# EAGLE design MARINEFORD (EAGLE 9.0.0)
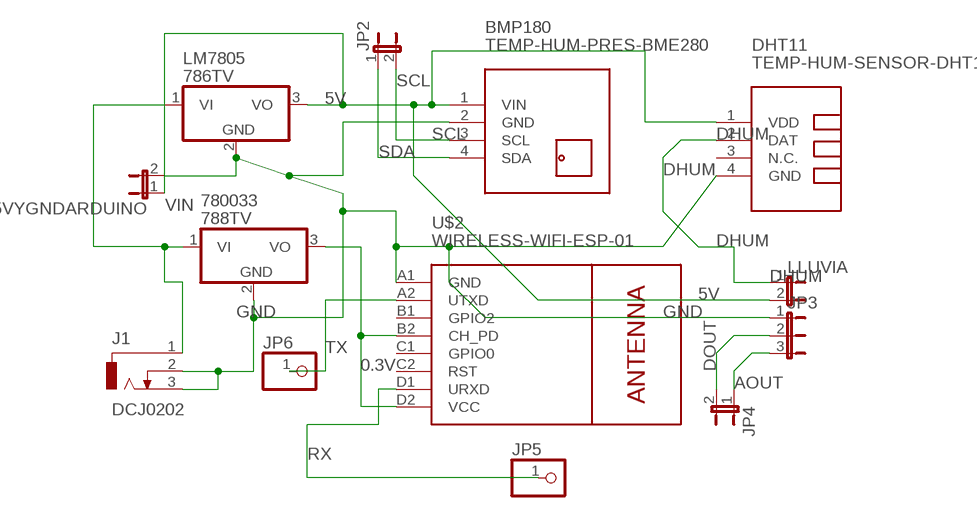
[diagram p0: schematic, sheet 1]

## Parts
5VYGNDARDUINO  JP1E  [JP1]
780033  788TV  [TO220V]
BMP180  TEMP-HUM-PRES-BME280  [TEMP-HUM-PRES-BME280]
DHT11  TEMP-HUM-SENSOR-DHT11  [TEMP-HUM-SENSOR-DHT11]
J1  DCJ0202  [DCJ0202]
JP2  JP1E  [JP1]
JP3  JP2E  [JP2]
JP4  JP1E  [JP1]
JP5  PINHD-1X1  [1X01]
JP6  PINHD-1X1  [1X01]
LLUVIA  JP1E  [JP1]
LM7805  786TV  [TO220V]
U$2  WIRELESS-WIFI-ESP-01  [WIRELESS-WIFI-ESP-01]

## Nets
0.3V: 780033.3(VO) U$2.B2(CH_PD) U$2.D2(VCC)
5V: 5VYGNDARDUINO.1 BMP180.1(VIN) DHT11.1(VDD) LLUVIA.2 LM7805.3(VO)
AOUT: JP3.3 JP4.1
DHUM: DHT11.2(DAT) LLUVIA.1
DOUT: JP3.2 JP4.2
GND: 5VYGNDARDUINO.2 780033.2(GND) BMP180.2(GND) DHT11.4(GND) J1.2 J1.3 JP3.1 LM7805.2(GND) U$2.A1(GND)
RX: JP5.1 U$2.D1(URXD)
SCL: BMP180.3(SCL) JP2.2
SDA: BMP180.4(SDA) JP2.1
TX: JP6.1 U$2.A2(UTXD)
VIN: 780033.1(VI) J1.1 LM7805.1(VI)
Unconnected: DHT11.3(N.C.) U$2.B1(GPIO2) U$2.C1(GPIO0) U$2.C2(RST)

## Library data of the parts
5VYGNDARDUINO JP2 JP4 LLUVIA = jumper:JP1E: JUMPER
780033 LM7805 = linear:78*: Positive VOLTAGE REGULATOR Source: http://cache.national.com/ds/LM/LM78L05.pdf http://www.fairchildsemi.com/ds/LM/LM7805.pdf
BMP180 = BME280:TEMP-HUM-PRES-BME280: Digital Humidity-Temperature-Pressure Sensor based on BME280 device More information about BME280 device is available here: https://www.bosch-sensortec.com/bst/products/all_products/bme280 Click here to find device on ebay.com <http://www.ebay.com/sch/bme280+breakout>
DHT11 = dht11:TEMP-HUM-SENSOR-DHT11: DHT11 - digital humidity & temperature sensor DHT11 datasheet available here: https://akizukidenshi.com/download/ds/aosong/DHT11.pdf Click here to find device on ebay.com <http://www.ebay.com/sch/dht11+digital+sensor>
J1 = con-jack:DCJ0202: DC POWER JACK Source: DCJ0202.pdf; OC_FARNELL: unknown; OC_NEWARK: unknown
JP3 = jumper:JP2E: JUMPER
JP5 JP6 = adafruit:PINHD-1X1: Pin header 1x1 for 0.1" spacing With round pins
U$2 = dht11:WIRELESS-WIFI-ESP-01: Wireless Wi-Fi ESP-01 Module based on ESP8266 chip Click here to find device on ebay.com <http://www.ebay.com/sch/esp8266+esp+01+transceiver>

## Board
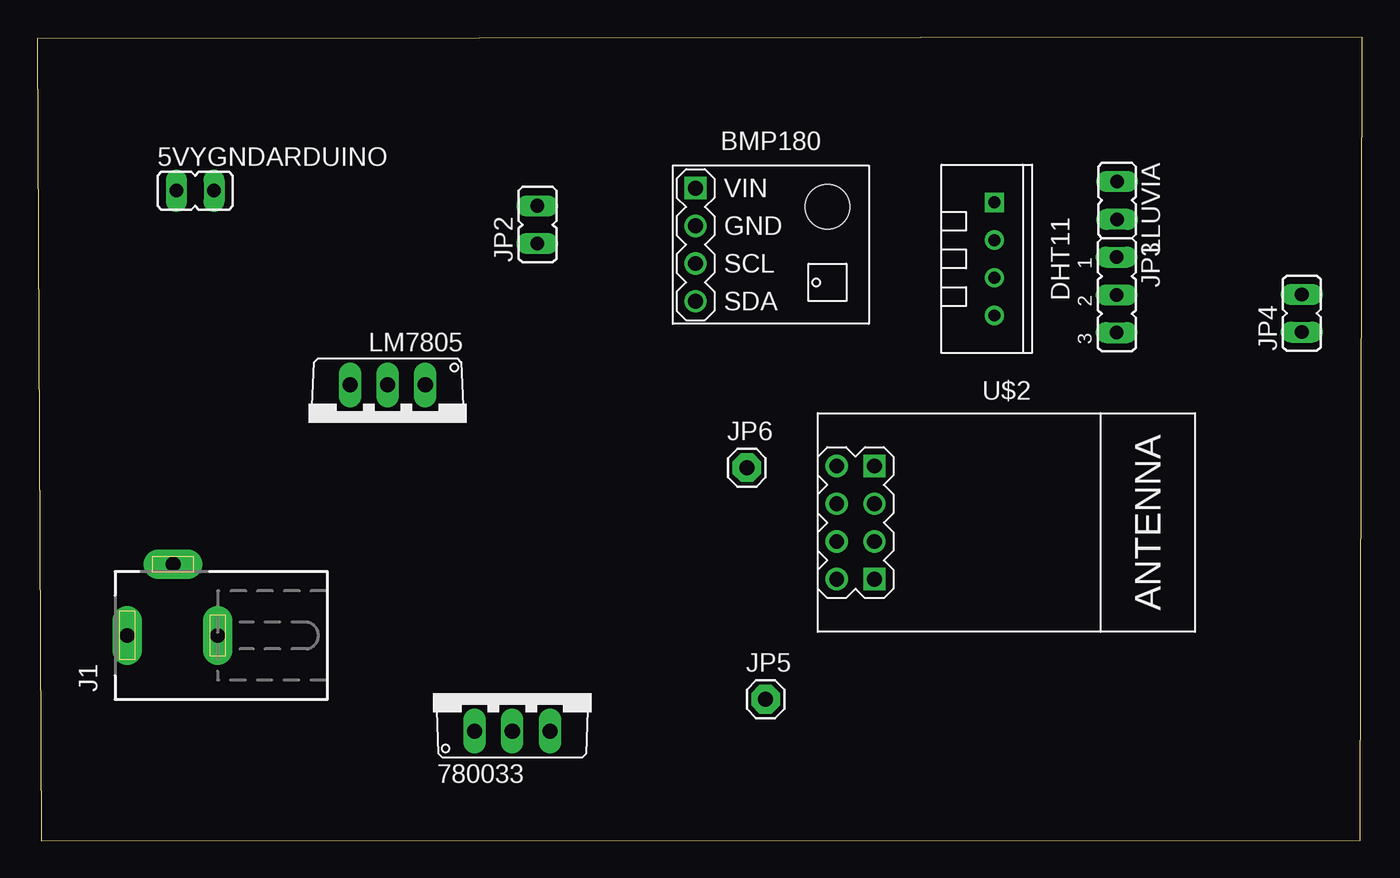
[diagram p1: board, top side]
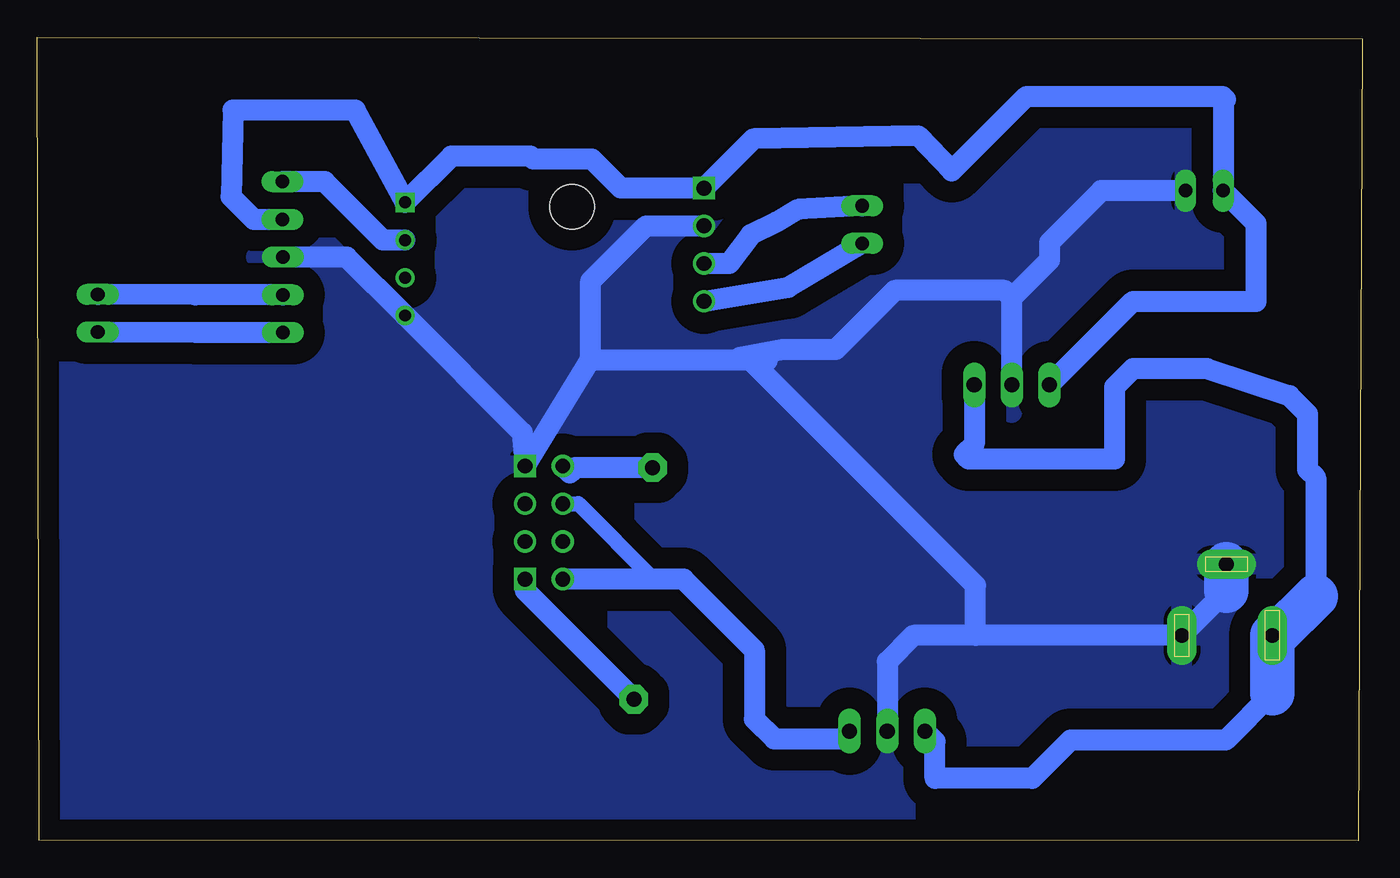
[diagram p2: board, bottom side, seen from below]

Size 89.3 x 54.13 mm. Coordinates in mm from the lower left corner, seen from the top.
Outline: 0.3,0 89.14,0.04 89.3,54.13 0,54.01 0.3,0
Copper layers (1*16): Top 0.035mm / dielectric 1.5mm / Bottom 0.035mm
Design rules "default *": minimum track width 6mil, minimum drill 0.35mm, track to track 15mil, track to pad 15mil, pad to pad 6mil, via to via 6mil, smd to smd 6mil, copper to edge 40mil, drill to drill 6mil, minimum pad ring 10mil, minimum via ring 8mil, stop-mask expansion 4mil, vias tented up to drill 0mil, thermal gap 10mil

### Footprints (pad centres in the part's own frame; a part is rotated, then mirrored left to right if it is on the bottom)
JP1 = drill 0.914 long: 1 0,-1.27; 2 0,1.27
TO220V = drill 1.016 long: 1 -2.54,-2.54; 2 0,-2.54; 3 2.54,-2.54
TEMP-HUM-PRES-BME280 = drill 1 square: 1 -5.08,3.81 | drill 1: 2 -5.08,1.27; 3 -5.08,-1.27; 4 -5.08,-3.81 | hole 3: 3.81,2.54
TEMP-HUM-SENSOR-DHT11 = drill 0.8 square: 1 -3.81,0 | drill 0.8: 2 -1.27,0; 3 1.27,0; 4 3.81,0
DCJ0202 = drill 1 pad 2 long: 1 0,3.1; 2 4.8,0; 3 0,-3
JP2 = drill 0.914 long: 1 -2.54,0; 2 0,0; 3 2.54,0
1X01 = drill 1.016 pad 1.93 octagon: 1 0,0
WIRELESS-WIFI-ESP-01 = drill 1 square: A1 -8.89,3.81; D1 -8.89,-3.81 | drill 1: A2 -11.43,3.81; B1 -8.89,1.27; B2 -11.43,1.27; C1 -8.89,-1.27; C2 -11.43,-1.27; D2 -11.43,-3.81

### Placement (x,y rotation side)
5VYGNDARDUINO  10.65,43.79 270 top
780033  32.02,9.92 0 top
BMP180  49.44,40.15 0 top
DHT11  64.5,39.2 270 top
J1  9.16,13.83 90 top
JP2  33.72,41.51 0 top
JP3  72.75,36.77 270 top
JP4  85.22,35.54 0 top
JP5  49.09,9.54 0 top
JP6  47.83,25.13 0 top
LLUVIA  72.77,43.13 180 top
LM7805  23.62,28.18 180 top
U$2  65.31,21.44 0 top

### Tracks (layer width: path | path; a pad name or v marks a point on that pad's centre or on a via)
0.3V
  Bottom 1.016: 47.75,17.62 52.83,22.7 U$2.B2
  Bottom 1.42: U$2.D2 47.75,17.62 45.74,17.62 40.97,12.85 40.97,8.2 39.63,6.87 35.08,6.87 780033.3
5V
  Bottom 1.42: LLUVIA.2 74.69,41.86 76.23,43.4 76.09,49.22 67.87,49.22 DHT11.1 61.38,46.12 56.08,46.12 55.88,45.92 51.91,45.92 49.96,43.96 BMP180.1 41.04,47.29 29.93,47.49 27.66,45.12 22.64,50.15 9.44,50.15 9.21,49.92 9.38,49.75 5VYGNDARDUINO.1 7.18,41.59 7.18,36.34 15.46,36.34 LM7805.3
AOUT
  Bottom 1.42: JP3.3 78.62,34.23 JP4.1
DHUM
  Bottom 1.42: DHT11.2 65.99,40.46 69.93,44.4 LLUVIA.1
DOUT
  Bottom 1.42: JP3.2 78.62,36.77 JP4.2
GND
  Bottom 1.42: 52,32.45 U$2.A1 56.61,27.49 DHT11.4 68.43,39.31 JP3.1 | 52,32.45 52,37.7 48.27,41.43 BMP180.2 | 40.09,32.37 41.23,32.37 | 41.23,32.37 51.91,32.37 52,32.45 | 780033.2 32.02,12.06 30.26,13.83 26.07,13.83 | 26.07,13.83 J1.3 9.16,16.83 | LM7805.2 23.62,36.57 | 23.62,36.57 24.12,37.07 31.52,37.07 35.5,33.09 39.07,33.09 41.97,32.55 | 26.07,13.83 26.07,17.21 41.23,32.37 | 23.62,36.57 21.08,39.12 21.08,40.3 17.59,43.79 5VYGNDARDUINO.2
  Bottom 3: J1.2 9.16,16.83
  pour Bottom (isolate 1.422): 0.19,53.51 0.19,0.94 2.42,1.07 88.05,1.07 88.34,1.35 88.34,53.23 88.47,53.36 2.85,53.36 2.56,53.65
RX
  Bottom 1.42: U$2.D1 56.42,16.87 JP5.1
SCL
  Bottom 1.42: JP2.2 38.03,42.54 39.49,41.66 41.21,40.82 42.67,38.88 BMP180.3
SDA
  Bottom 1.42: BMP180.4 38.7,37.29 JP2.1
TX
  Bottom 1.42: U$2.A2 53.41,24.77 53.04,25.13 JP6.1
VIN
  Bottom 1.42: 6.06,9.94 9.21,6.79 19.67,6.79 22.25,4.21 28.8,4.21 28.8,6.7 780033.1 | 3.16,16.46 3.16,24.48 3.7,25.02 3.7,28.76 4.93,29.99 10.45,31.81 15.46,31.81 16.7,30.57 16.7,25.71 26.54,25.71 26.85,26.02 26.16,26.71 LM7805.1 | 5.79,13.83 J1.1
  Bottom 3: J1.1 6.06,9.94 | 3.16,16.46 5.79,13.83